# Altium schematic sheet ZX62-B-5PA11.SchDoc
size A4
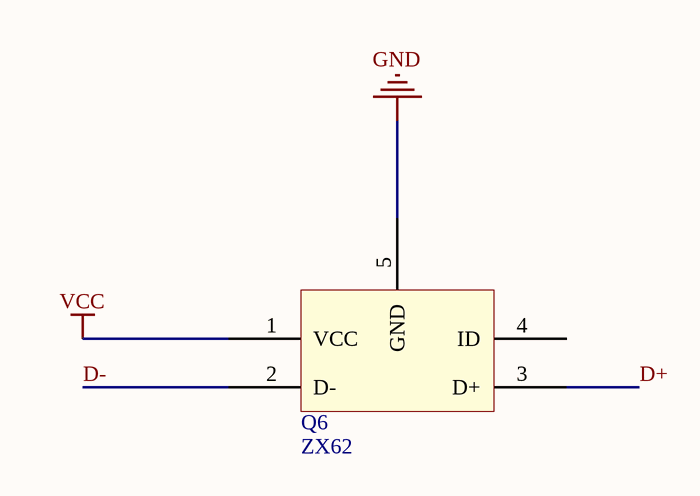
[diagram p0: ZX62-B-5PA11.SchDoc]

## Parts
Q6  ZX62

## Nets
GND: Q6.5(GND)
VCC: Q6.1(VCC)
D+: Q6.3(D+)
D-: Q6.2(D-)

Not connected (* = marked no-connect by the designer): Q6 4(ID)

## Library data of the parts
Q6 = Component_1